# Altium schematic sheet Qunyin_mmWave_mainPowers.SchDoc: mmWave_iwr6843aop
size 457 x 292 mm; DrawnBy: Wxd; Organization: Shanghai Qunyin; Address1: Xianxia Rd 601; Address2: Changning district; Address3: Shanghai; DocumentNumber: 2; SheetNumber: 2; SheetTotal: 6
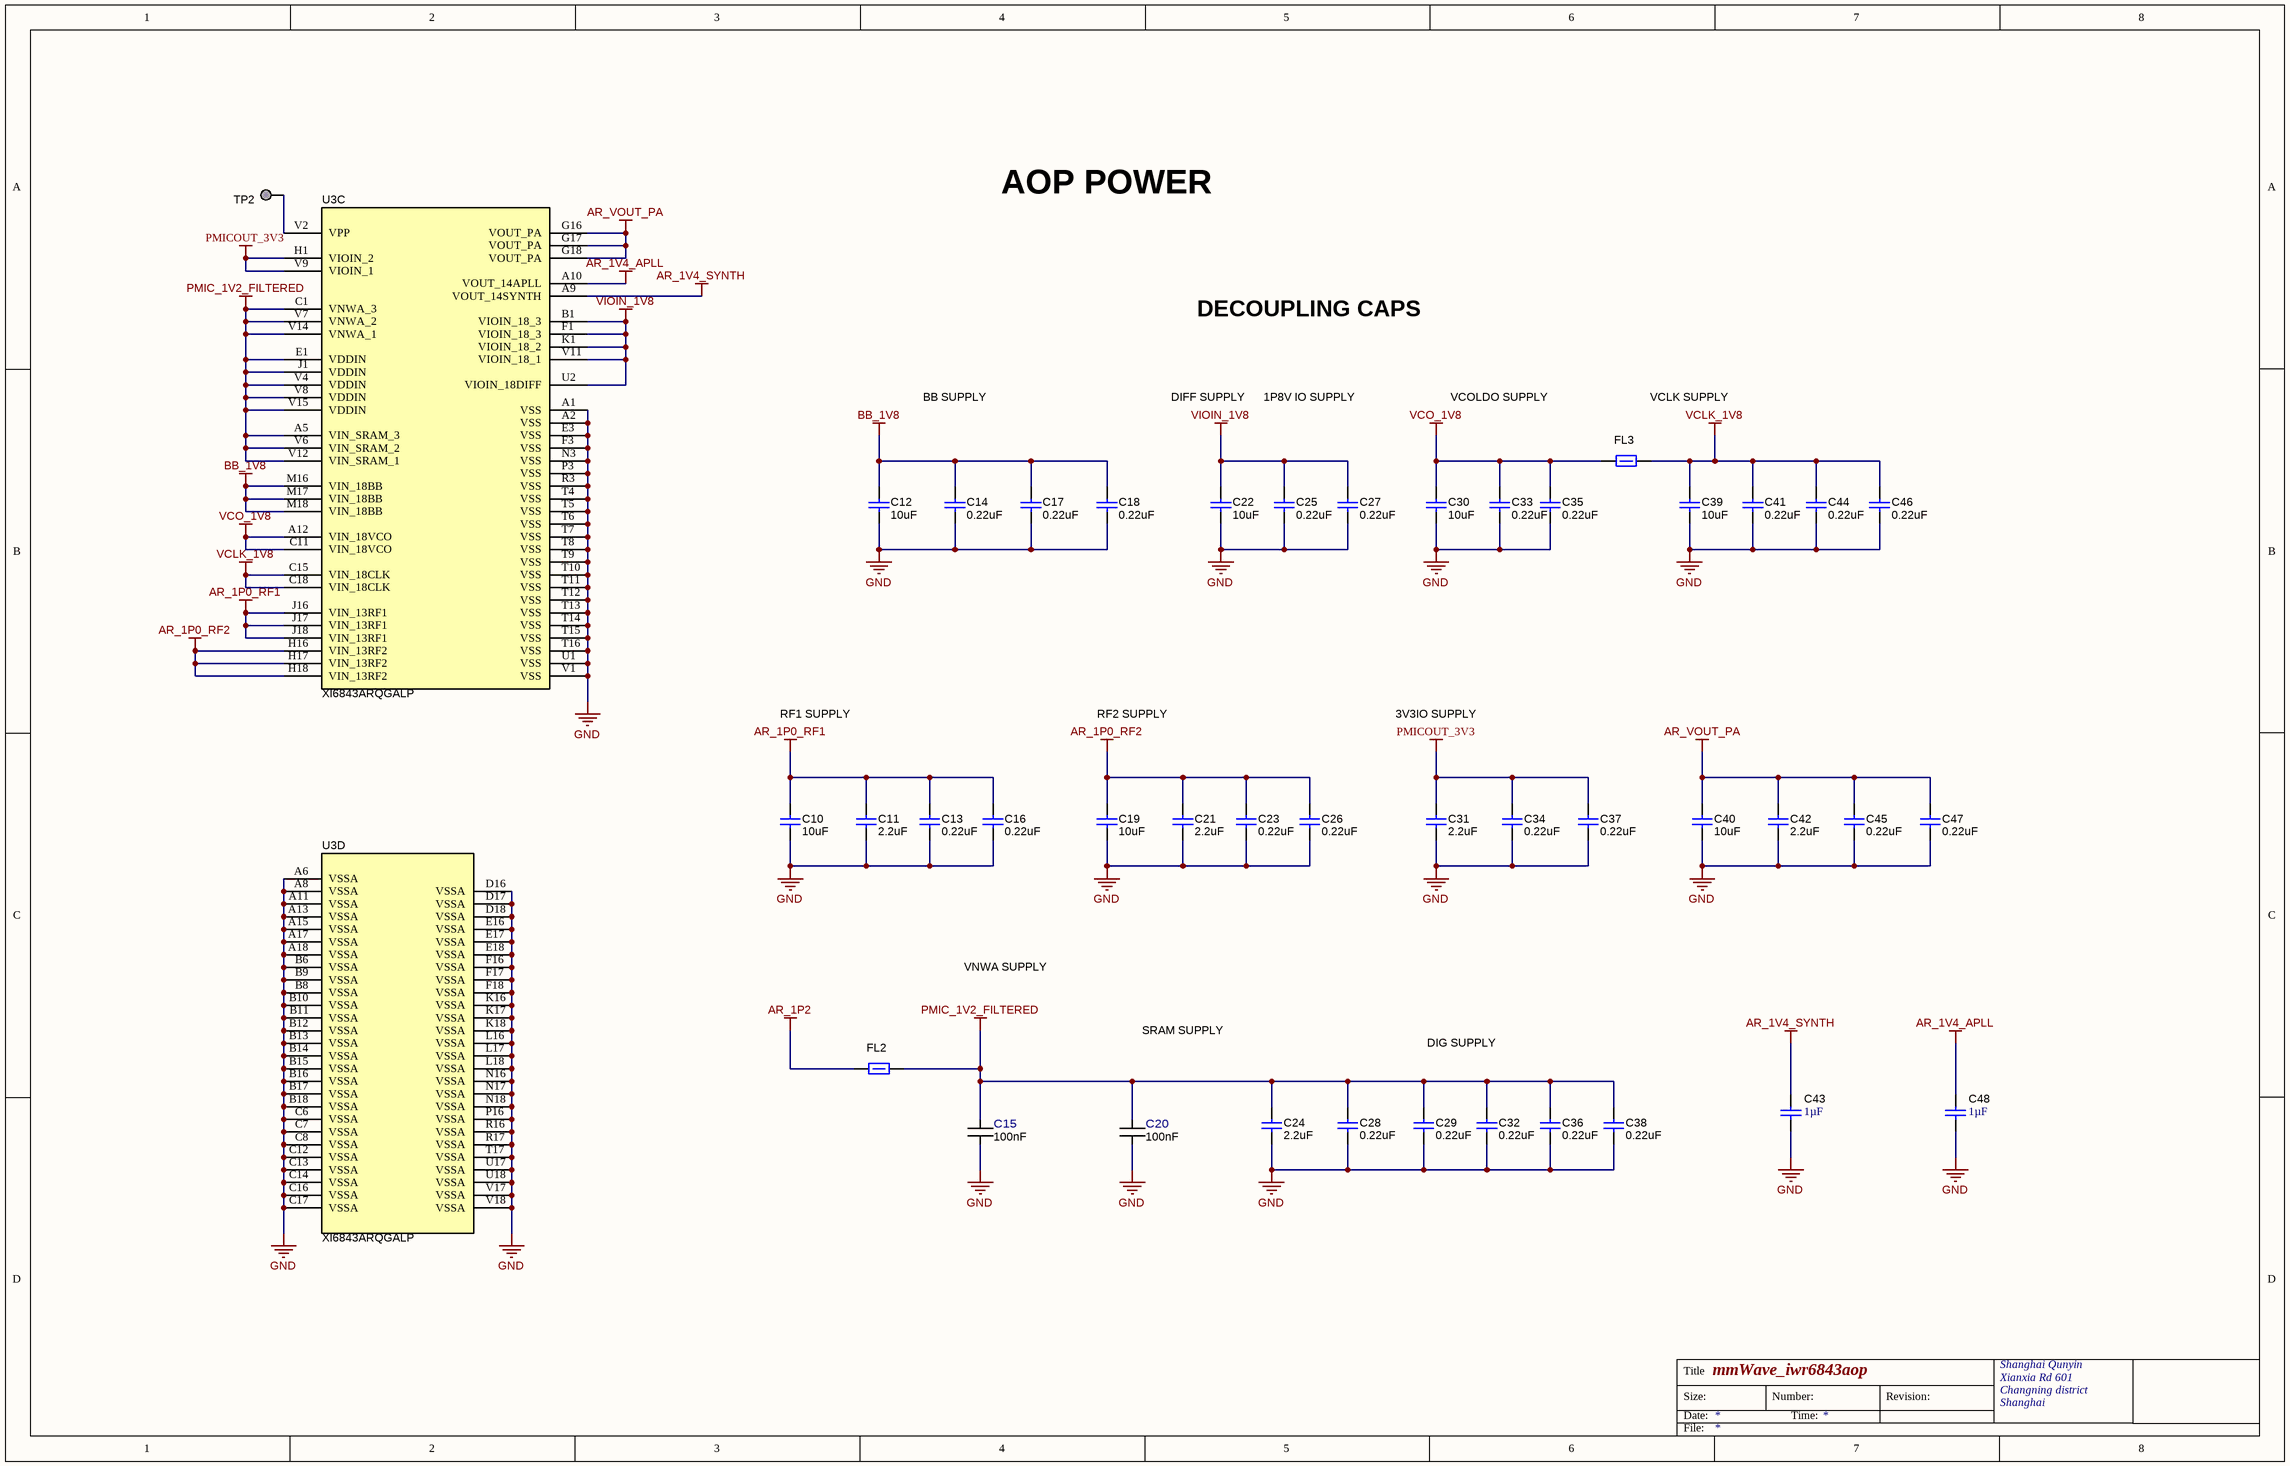
[diagram p0: Qunyin_mmWave_mainPowers.SchDoc]

## Parts
C10  value 10uF  [0402_070]  (hidden comment: CL05A106MP5NUNC)
C11  value 2.2uF  [0201L]  (hidden comment: CL03A225MQ3CRNC)
C12  value 10uF  [0402_070]  (hidden comment: CL05A106MP5NUNC)
C13  value 0.22uF  [0201_033L]  (hidden comment: LMK063BJ224MP-F)
C14  value 0.22uF  [0201_033L]  (hidden comment: LMK063BJ224MP-F)
C15  Cap_F: 100nF  [FP-GRM033R6YA104KE14D_0201 (0603 Metric)-IPC_C]  (hidden comment: GRM033R6YA104KE14D)
C16  value 0.22uF  [0201_033L]  (hidden comment: LMK063BJ224MP-F)
C17  value 0.22uF  [0201_033L]  (hidden comment: LMK063BJ224MP-F)
C18  value 0.22uF  [0201_033L]  (hidden comment: LMK063BJ224MP-F)
C19  value 10uF  [0402_070]  (hidden comment: CL05A106MP5NUNC)
C20  Cap_F: 100nF  [FP-GRM033R6YA104KE14D_0201 (0603 Metric)-IPC_C]  (hidden comment: GRM033R6YA104KE14D)
C21  value 2.2uF  [0201L]  (hidden comment: CL03A225MQ3CRNC)
C22  value 10uF  [0402_070]  (hidden comment: CL05A106MP5NUNC)
C23  value 0.22uF  [0201_033L]  (hidden comment: LMK063BJ224MP-F)
C24  value 2.2uF  [0201L]  (hidden comment: CL03A225MQ3CRNC)
C25  value 0.22uF  [0201_033L]  (hidden comment: LMK063BJ224MP-F)
C26  value 0.22uF  [0201_033L]  (hidden comment: LMK063BJ224MP-F)
C27  value 0.22uF  [0201_033L]  (hidden comment: LMK063BJ224MP-F)
C28  value 0.22uF  [0201_033L]  (hidden comment: LMK063BJ224MP-F)
C29  value 0.22uF  [0201_033L]  (hidden comment: LMK063BJ224MP-F)
C30  value 10uF  [0402_070]  (hidden comment: CL05A106MP5NUNC)
C31  value 2.2uF  [0201L]  (hidden comment: CL03A225MQ3CRNC)
C32  value 0.22uF  [0201_033L]  (hidden comment: LMK063BJ224MP-F)
C33  value 0.22uF  [0201_033L]  (hidden comment: LMK063BJ224MP-F)
C34  value 0.22uF  [0201_033L]  (hidden comment: LMK063BJ224MP-F)
C35  value 0.22uF  [0201_033L]  (hidden comment: LMK063BJ224MP-F)
C36  value 0.22uF  [0201_033L]  (hidden comment: LMK063BJ224MP-F)
C37  value 0.22uF  [0201_033L]  (hidden comment: LMK063BJ224MP-F)
C38  value 0.22uF  [0201_033L]  (hidden comment: LMK063BJ224MP-F)
C39  value 10uF  [0402_070]  (hidden comment: CL05A106MP5NUNC)
C40  value 10uF  [0402_070]  (hidden comment: CL05A106MP5NUNC)
C41  value 0.22uF  [0201_033L]  (hidden comment: LMK063BJ224MP-F)
C42  value 2.2uF  [0201L]  (hidden comment: CL03A225MQ3CRNC)
C43  ValueDisplayed: 1µF  [0402L]  (hidden comment: CGB2A1X6S0J105K033BC)
C44  value 0.22uF  [0201_033L]  (hidden comment: LMK063BJ224MP-F)
C45  value 0.22uF  [0201_033L]  (hidden comment: LMK063BJ224MP-F)
C46  value 0.22uF  [0201_033L]  (hidden comment: LMK063BJ224MP-F)
C47  value 0.22uF  [0201_033L]  (hidden comment: LMK063BJ224MP-F)
C48  ValueDisplayed: 1µF  [0402L]  (hidden comment: CGB2A1X6S0J105K033BC)
FL2  BLM15PD300SZ1D  [0402L]  (value not drawn)
FL3  BLM15PD300SZ1D  [0402L]  (value not drawn)
TP2  TESTPOINT  [TP_25MIL-SMT]  (value not drawn)  (no BOM)
U3  XI6843ARQGALP  [ALP0180A]  (parts C,D of 4)

## Nets
AR_1P0_RF1: C10.1 C11.1 C13.1 C16.1 U3.J16(VIN_13RF1) U3.J17(VIN_13RF1) U3.J18(VIN_13RF1)
AR_1P0_RF2: C19.1 C21.1 C23.1 C26.1 U3.H16(VIN_13RF2) U3.H17(VIN_13RF2) U3.H18(VIN_13RF2)
AR_1P2: FL2.1
AR_1V4_APLL: C48.1 U3.A10(VOUT_14APLL)
AR_1V4_SYNTH: C43.1 U3.A9(VOUT_14SYNTH)
AR_VOUT_PA: C40.1 C42.1 C45.1 C47.1 U3.G16(VOUT_PA) U3.G17(VOUT_PA) U3.G18(VOUT_PA)
BB_1V8: C12.1 C14.1 C17.1 C18.1 U3.M16(VIN_18BB) U3.M17(VIN_18BB) U3.M18(VIN_18BB)
GND: C10.2 C11.2 C12.2 C13.2 C14.2 C15.2 C16.2 C17.2 C18.2 C19.2 C20.2 C21.2 C22.2 C23.2 C24.2 C25.2 C26.2 C27.2 C28.2 C29.2 C30.2 C31.2 C32.2 C33.2 C34.2 C35.2 C36.2 C37.2 C38.2 C39.2 C40.2 C41.2 C42.2 C43.2 C44.2 C45.2 C46.2 C47.2 C48.2 U3.A1(VSS) U3.A2(VSS) U3.A6(VSSA) U3.A8(VSSA) U3.A11(VSSA) U3.A13(VSSA) U3.A15(VSSA) U3.A17(VSSA) U3.A18(VSSA) U3.B6(VSSA) U3.B8(VSSA) U3.B9(VSSA) U3.B10(VSSA) U3.B11(VSSA) U3.B12(VSSA) U3.B13(VSSA) U3.B14(VSSA) U3.B15(VSSA) U3.B16(VSSA) U3.B17(VSSA) U3.B18(VSSA) U3.C6(VSSA) U3.C7(VSSA) U3.C8(VSSA) U3.C12(VSSA) U3.C13(VSSA) U3.C14(VSSA) U3.C16(VSSA) U3.C17(VSSA) U3.D16(VSSA) U3.D17(VSSA) U3.D18(VSSA) U3.E3(VSS) U3.E16(VSSA) U3.E17(VSSA) U3.E18(VSSA) U3.F3(VSS) U3.F16(VSSA) U3.F17(VSSA) U3.F18(VSSA) U3.K16(VSSA) U3.K17(VSSA) U3.K18(VSSA) U3.L16(VSSA) U3.L17(VSSA) U3.L18(VSSA) U3.N3(VSS) U3.N16(VSSA) U3.N17(VSSA) U3.N18(VSSA) U3.P3(VSS) U3.P16(VSSA) U3.R3(VSS) U3.R16(VSSA) U3.R17(VSSA) U3.T4(VSS) U3.T5(VSS) U3.T6(VSS) U3.T7(VSS) U3.T8(VSS) U3.T9(VSS) U3.T10(VSS) U3.T11(VSS) U3.T12(VSS) U3.T13(VSS) U3.T14(VSS) U3.T15(VSS) U3.T16(VSS) U3.T17(VSSA) U3.U1(VSS) U3.U17(VSSA) U3.U18(VSSA) U3.V1(VSS) U3.V17(VSSA) U3.V18(VSSA)
PMIC_1V2_FILTERED: C15.1 C20.1 C24.1 C28.1 C29.1 C32.1 C36.1 C38.1 FL2.2 U3.A5(VIN_SRAM_3) U3.C1(VNWA_3) U3.E1(VDDIN) U3.J1(VDDIN) U3.V4(VDDIN) U3.V6(VIN_SRAM_2) U3.V7(VNWA_2) U3.V8(VDDIN) U3.V12(VIN_SRAM_1) U3.V14(VNWA_1) U3.V15(VDDIN)
PMICOUT_3V3: C31.1 C34.1 C37.1 U3.H1(VIOIN_2) U3.V9(VIOIN_1)
VCLK_1V8: C39.1 C41.1 C44.1 C46.1 FL3.2 U3.C15(VIN_18CLK) U3.C18(VIN_18CLK)
VCO_1V8: C30.1 C33.1 C35.1 FL3.1 U3.A12(VIN_18VCO) U3.C11(VIN_18VCO)
VIOIN_1V8: C22.1 C25.1 C27.1 U3.B1(VIOIN_18_3) U3.F1(VIOIN_18_3) U3.K1(VIOIN_18_2) U3.U2(VIOIN_18DIFF) U3.V11(VIOIN_18_1)
NetTP2_1: TP2.1 U3.V2(VPP)

## Notes on the sheet
- AOP POWER
- DECOUPLING CAPS
- BB SUPPLY
- DIFF SUPPLY
- 1P8V IO SUPPLY
- VCOLDO SUPPLY
- VCLK SUPPLY
- RF1 SUPPLY
- RF2 SUPPLY
- 3V3IO SUPPLY
- VNWA SUPPLY
- SRAM SUPPLY
- DIG SUPPLY
- Title
- Size:
- Date:
- Number:
- Time:
- Revision:
- File:

## Library data of the parts
C10 C12 C19 C22 C30 C39 C40 = CMP-0006339-4: CAP, CERM, 10 uF, 10 V, +/- 20%, X5R, 0402; Manufacturer: Samsung Electro-Mechanics; AEC Category: Q200; AEC Qualified: N; Cap_Case: 0402; Cap_F: 10µF; SizeArea_mm2: 0.5; SizeAreaWB_mm2: 3; SizeX_mm: 1; SizeZ_mm: 0.6; TaMax_C: 85°C; TaMin_C: -55°C; U/M: EA; Value1: Unknown; Value2: 10V; RoHS: Y; AEC Grade: N/A; ComponentLink1Description: Datasheet link; ComponentLink1URL: http://www.samsungsem.com/kr/support/product-search/mlcc/__icsFiles/afieldfile/2018/06/21/CL05A106MP5NUNC.pdf; CompType: Capacitor; MountType: SMT; PackageReference: 0402; PartNumber: CL05A106MP5NUNC; Polarized: N; SizeY_mm: 0.5; Technology: Ceramic; TempCo: X5R; Tolerance_%: 20%; ValueDisplayed: 10uF; VDC_V: 10V
C11 C21 C24 C31 C42 = CMP-0009657-3: CAP, CERM, 2.2 uF, 6.3 V, +/- 20%, X5R, 0201; Manufacturer: Samsung Electro-Mechanics; AEC Category: Q200; Cap_Case: 0201; Cap_F: 2.2µF; Polarized: N; SizeArea_mm2: 0.18; SizeAreaWB_mm2: 2.08; SizeX_mm: 0.6; SizeY_mm: 0.3; SizeZ_mm: 0.26; TaMax_C: 85°C; TaMin_C: -55°C; U/M: EA; Value1: Unknown; Value2: 6.3V; RoHS: Y; AEC Qualified: ?; ComponentLink1Description: Datasheet link; ComponentLink1URL: http://www.samsungsem.com/servlet/FileDownload?type=spec&file=CL03A225MQ3CRNC.pdf; CompType: Capacitor; MountType: SMT; PackageReference: 0201; PartNumber: CL03A225MQ3CRNC; Technology: Ceramic; TempCo: X5R; Tolerance_%: 20%; ValueDisplayed: 2.2uF; VDC_V: 6.3V; LatestRevisionDate: 2017-03-09; Published: 2008-06-19; Publisher: Texas Instruments
C13 C14 C16-C18 C23 C25-C29 C32-C38 C41 C44-C47 = CMP-0009781-1: CAP, CERM, 0.22 uF, 10 V, +/- 20%, X5R, 0201; Manufacturer: Taiyo Yuden; AEC Category: Q200; AEC Qualified: N; Cap_Case: 0201; Cap_F: 220nF; SizeArea_mm2: 0.18; SizeAreaWB_mm2: 2.08; SizeX_mm: 0.6; SizeY_mm: 0.3; SizeZ_mm: 0.33; TaMax_C: 85°C; TaMin_C: -55°C; U/M: EA; Value1: Unknown; Value2: 10V; RoHS: Y; AEC Grade: N/A; ComponentLink1Description: Datasheet link; ComponentLink1URL: http://www.yuden.co.jp/productdata/catalog/en/mlcc_all_e.pdf; CompType: Capacitor; LatestRevisionDate: 2017-03-09; MountType: SMT; PackageReference: 0201; PartNumber: LMK063BJ224MP-F; Polarized: N; Published: 2008-06-19; Publisher: Texas Instruments; Supplier 1: Digi-Key; Supplier 2: Newark; Supplier 3: Mouser; Supplier Part Number 1: 587-2483-1-ND; Supplier Part Number 2: 48T3327; Supplier Part Number 3: 963-LMK063BJ224MP-F; Technology: Ceramic; TempCo: X5R; Tolerance_%: 20%; ValueDisplayed: 0.22uF; VDC_V: 10V
C15 C20 = CMP-0086440-1: Cap Ceramic 0.1uF 35V X5R 10% Pad SMD 0201 85C T/R; Manufacturer: Murata Electronics North America; AEC Qualified: No; SizeZ_mm: 0.33mm; Symbol Name: SYM-GRM033R6YA104KE14D; TempCo: 15%; RoHS: TRUE; ComponentLink1Description: Datasheet; ComponentLink1URL: https://search.murata.co.jp/Ceramy/image/img/A01X/G101/ENG/GRM033R6YA104KE14-01.pdf; PackageReference: 0201 (0603 Metric); PartNumber: GRM033R6YA104KE14D; Tolerance_%: 10%; VDC_V: 35V
C43 C48 = CMP-0081763-1: CAP, CERM, 1 µF, 6.3 V,+/- 10%, X6S, 0402; Manufacturer: TDK; TaMin_C: -55°C; Polarized: N; SizeAreaWB_mm2: 3; U/M: EA; Value: 1uF; TaMax_C: 105°C; SizeZ_mm: 0.6; SizeX_mm: 1; SizeY_mm: 0.5; Cap_Case: 0402; Value2: 6.3V; CompType: Capacitor; AEC Category: Q200; ComponentLink1URL: https://product.tdk.com/info/en/catalog/datasheets/mlcc_commercial_lowprofile_en.pdf; Supplier Part Number 2: 810-CGB2A1X6S0J105KC; Supplier 2: Mouser; TempCo: X6S; RoHS: Y; MountType: SMT; Supplier 1: Digi-Key; PackageReference: 0402; Tolerance_%: 10%; SizeArea_mm2: 0.5; PartNumber: CGB2A1X6S0J105K033BC; AEC Qualified: N; Cap_F: 1µF; VDC_V: 6.3V; ComponentLink1Description: Datasheet link; AEC Grade: N/A; Supplier Part Number 1: 445-13189-1-ND; Technology: Ceramic
FL2 FL3 = CMP-0078934-1: Inductor, Ferrite Bead, Ferrite, 2.2 A, 0.035 ohm, AEC-Q200 Grade 1, SMD; Manufacturer: MuRata; AEC Category: Q200; AEC Grade: 1; AEC Qualified: Y; DCR_ohm: 0.035; Imax_A: 2.2A; SizeArea_mm2: 0.5; SizeAreaWB_mm2: 3; SizeZ_mm: 0.6; RoHS: Y; ComponentLink1Description: Datasheet link; ComponentLink1URL: https://www.murata.com/en-us/products/productdata/8796748677150/QNFA9118.pdf; CompType: Inductor; LatestRevisionDate: 2017-12-07; Material: Ferrite; MountType: SMT; PackageReference: 0402; PartNumber: BLM15PD300SZ1D; Published: 2008-06-26; Publisher: Texas Instruments; SizeX_mm: 1; SizeY_mm: 0.5; Supplier 1: Digi-Key; Supplier 2: Mouser; Supplier Part Number 1: 490-16506-1-ND; Supplier Part Number 2: 81-BLM15PD300SZ1D; Technology: Ferrite Bead; Value1: 0.035 ohm; Value2: 2.2A
TP2 = CMP-0078143-3: TEST POINT.  No entry in BOM.; CompType: Testpoint; Manufacturer: N/A; PackageReference: N/A; PartNumber: N/A; Library Reference: TESTPOINT
U3 = CMP-0860942-2: XI6843ARQGALP, ALP0180A (BGA-180); Manufacturer: Texas Instruments; SizeZ_mm: 0.965; SizeX_mm: 15; AEC Qualified: N; SizeArea_mm2: 225; SizeAreaWB_mm2: 289; CompType: IC; AEC Category: Q200; MountType: SMT; ComponentLink2URL: http://www.ti.com/product/xi6843arqg; Alternate Manufacturer: Texas Instruments; ComponentLink2Description: Product Folder; ComponentLink3Description: Online Datasheet; PackageReference: ALP0180A; ComponentLink1URL: http://www.ti.com/lit/ds/symlink/xi6843arqg.pdf; PartNumber: XI6843ARQGALP; PackageDescription: BGA-180; ComponentLink1Description: Datasheet Link; ComponentLink3URL: http://www.ti.com/product/xi6843arqg/datasheet; SizeY_mm: 15